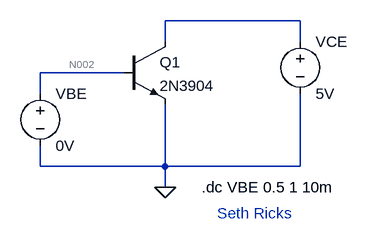
[diagram p0: schematic BJT_transistors.asc]
BJT_transistors.asc, the LTspice schematic file:
Version 4.1
SHEET 1 880 680
WIRE 352 112 144 112
WIRE 144 144 144 112
WIRE 352 144 352 112
WIRE 80 192 -48 192
WIRE -48 224 -48 192
WIRE -48 336 -48 304
WIRE 144 336 144 240
WIRE 144 336 -48 336
WIRE 352 336 352 224
WIRE 352 336 144 336
WIRE 144 368 144 336
FLAG 144 368 0
SYMBOL voltage -48 208 R0
WINDOW 123 0 0 Left 0
WINDOW 39 0 0 Left 0
SYMATTR InstName VBE
SYMATTR Value 0V
SYMBOL voltage 352 128 R0
SYMATTR InstName VCE
SYMATTR Value 5V
SYMBOL npn 80 144 R0
SYMATTR InstName Q1
SYMATTR Value 2N3904
TEXT 200 368 Left 2 !.dc VBE 0.5 1 10m
TEXT 224 408 Left 2 ;Seth Ricks

The netlist it stands for:
* BJT_transistors.asc
VBE N002 0 0V
VCE N001 0 5V
Q1 N001 N002 0 0 2N3904
.model NPN NPN
.model PNP PNP
.lib standard.bjt
.dc VBE 0.5 1 10m
* Seth Ricks
.backanno
.end

* Results of the author's LTspice run, read from the files saved beside the schematic
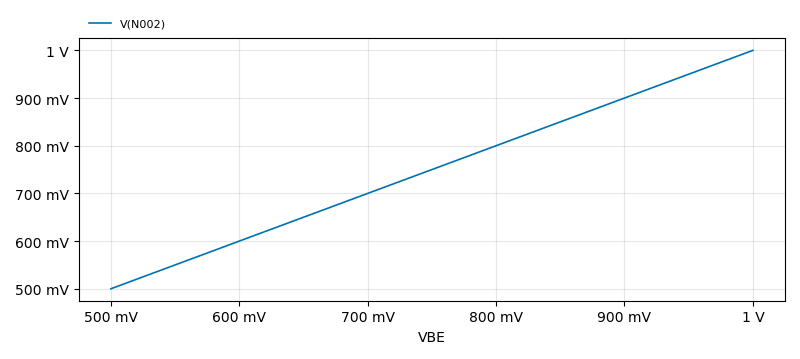
[diagram p1: DC transfer characteristic of BJT_transistors.asc, plotted from the saved traces]
* DC transfer characteristic, 1 run:
*   V(N002): 500 mV at VBE=500 mV, 1 V at VBE=1 V, min 500 mV, max 1 V